# Altium project FPGA扩展板.PrjPcb
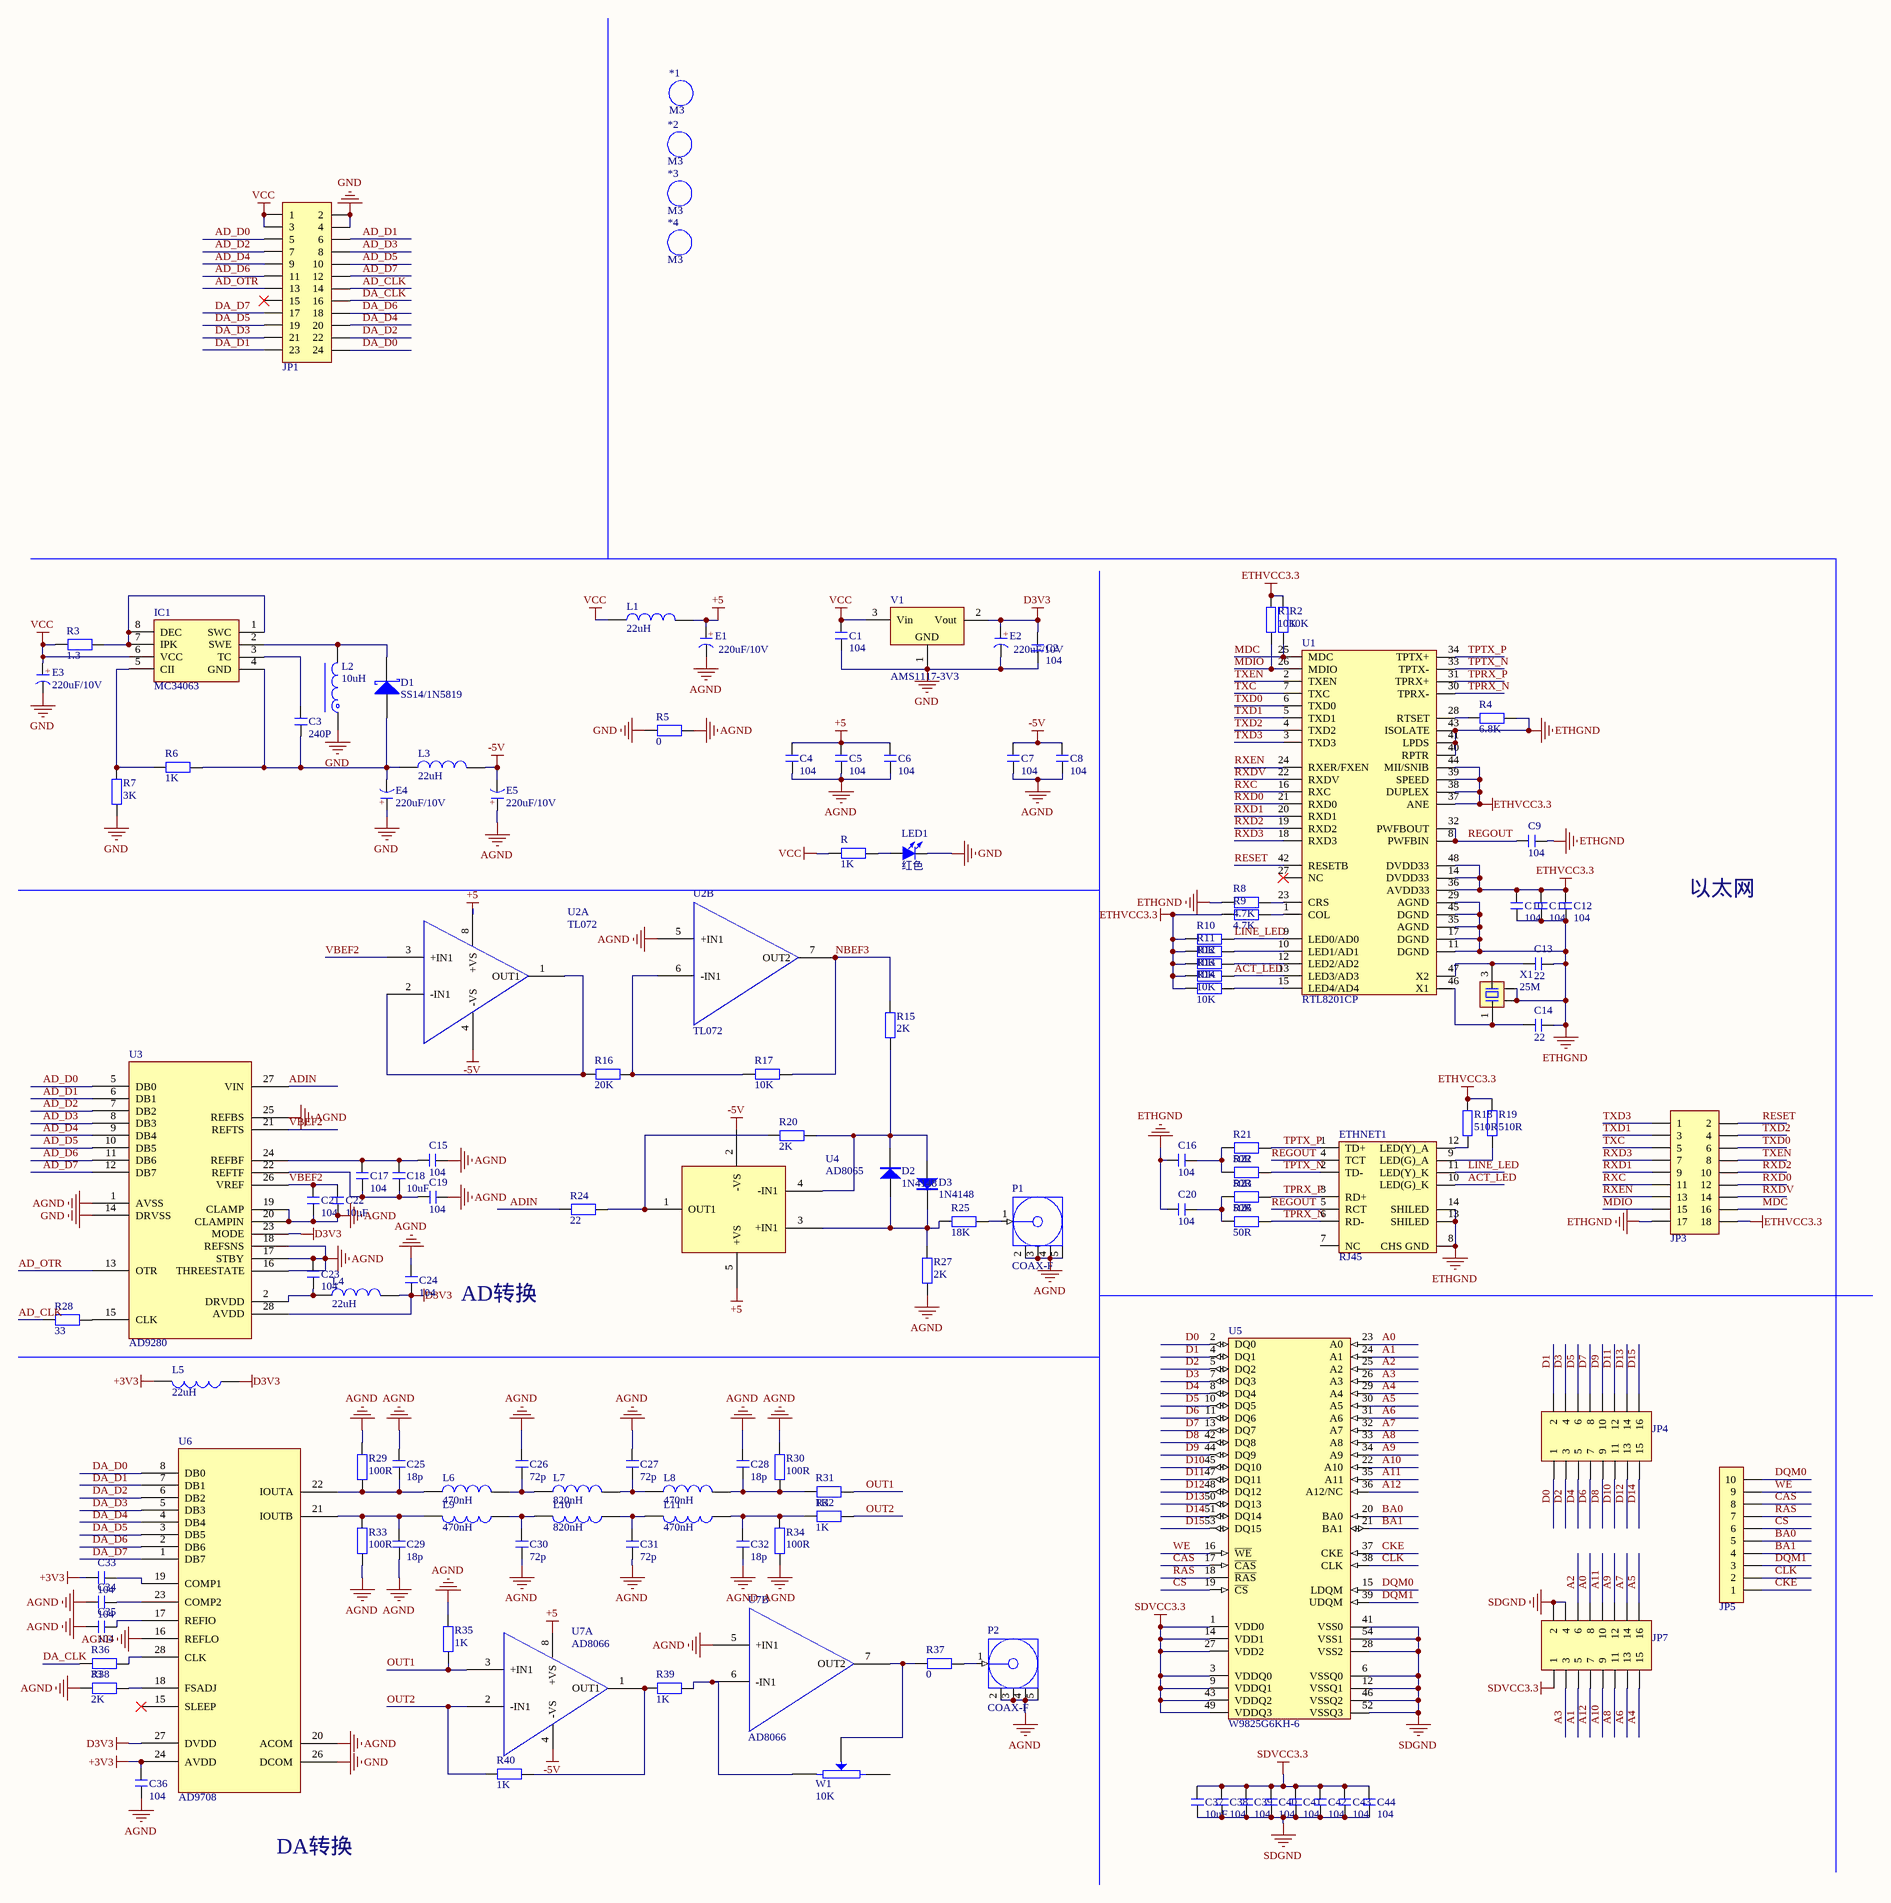
[diagram p0: FPGA扩展板.SchDoc]
1 sheet, 128 parts. Net scope: global (net labels, ports and power ports of the same name join across sheets).
Board file: FPGA扩展板.PcbDoc

## Sheet FPGA扩展板.SchDoc
size A2

### Parts
*1  M3  [M3 125X300]
*2  M3  [M3 125X300]
*3  M3  [M3 125X300]
*4  M3  [M3 125X300]
C1  104  [C 0805_L]
C2  104  [C 0805_L]
C3  240P  [C 0805_L]
C4  104  [C 0805_L]
C5  104  [C 0805_L]
C6  104  [C 0805_L]
C7  104  [C 0805_L]
C8  104  [C 0805_L]
C9  104  [C 0805_L]
C10  104  [C 0805_L]
C11  104  [C 0805_L]
C12  104  [C 0805_L]
C13  22  [C 0805_L]
C14  22  [C 0805_L]
C15  104  [C 0805_L]
C16  104  [C 0805_L]
C17  104  [C 0805_L]
C18  10uF  [C 0805_L]
C19  104  [C 0805_L]
C20  104  [C 0805_L]
C21  104  [C 0805_L]
C22  10uF  [C 0805_L]
C23  104  [C 0805_L]
C24  104  [C 0805_L]
C25  18p  [C 0805_L]
C26  72p  [C 0805_L]
C27  72p  [C 0805_L]
C28  18p  [C 0805_L]
C29  18p  [C 0805_L]
C30  72p  [C 0805_L]
C31  72p  [C 0805_L]
C32  18p  [C 0805_L]
C33  104  [C 0805_L]
C34  104  [C 0805_L]
C35  104  [C 0805_L]
C36  104  [C 0805_L]
C37  10uF  [C 0805_L]
C38  104  [C 0805_L]
C39  104  [C 0805_L]
C40  104  [C 0805_L]
C41  104  [C 0805_L]
C42  104  [C 0805_L]
C43  104  [C 0805_L]
C44  104  [C 0805_L]
D1  SS14/1N5819  [SMA]
D2  1N4148  [MINI_MELF (LL34)]
D3  1N4148  [MINI_MELF (LL34)]
E1  220uF/10V  [CM D(6.3*5.4)]
E2  220uF/10V  [CM D(6.3*5.4)]
E3  220uF/10V  [CM D(6.3*5.4)]
E4  220uF/10V  [CM D(6.3*5.4)]
E5  220uF/10V  [CM D(6.3*5.4)]
ETHNET1  RJ45  [HR911105A]
IC1  MC34063  [SOP8_N]
JP1  Header 2X11  [HDR2.54-LI-2x12P]  (value not drawn)
JP3  Header 9X2  [HDR2.54-LI-2x9P]  (value not drawn)
JP4  Header 8X2  [HDR2.54-LI-2x8P]  (value not drawn)
JP5  HDR-1X10  [HDR2.54-LI-10P]  (value not drawn)
JP7  Header 8X2  [HDR2.54-LI-2x8P]  (value not drawn)
L1  22uH  [L 0805]
L2  10uH  [CDRH73]
L3  22uH  [L 0805]
L4  22uH  [L 0805]
L5  22uH  [L 0805]
L6  470nH  [L 0805]
L7  820nH  [L 0805]
L8  470nH  [L 0805]
L9  470nH  [L 0805]
L10  820nH  [L 0805]
L11  470nH  [L 0805]
LED1  红色  [LED 0805B]
P1  COAX-F  [MCX5.08-H5]
P2  COAX-F  [MCX5.08-H5]
R  1K  [R 0805_L]
R1  10K  [R 0805_L]
R2  10K  [R 0805_L]
R3  1.3  [R 0805_L]
R4  6.8K  [R 0805_L]
R5  0  [R 0805_L]
R6  1K  [R 0805_L]
R7  3K  [R 0805_L]
R8  4.7K  [R 0805_L]
R9  4.7K  [R 0805_L]
R10  10K  [R 0805_L]
R11  10K  [R 0805_L]
R12  10K  [R 0805_L]
R13  10K  [R 0805_L]
R14  10K  [R 0805_L]
R15  2K  [R 0805_L]
R16  20K  [R 0805_L]
R17  10K  [R 0805_L]
R18  510R  [R 0805_L]
R19  510R  [R 0805_L]
R20  2K  [R 0805_L]
R21  50R  [R 0805_L]
R22  50R  [R 0805_L]
R23  50R  [R 0805_L]
R24  22  [R 0805_L]
R25  18K  [R 0805_L]
R26  50R  [R 0805_L]
R27  2K  [R 0805_L]
R28  33  [R 0805_L]
R29  100R  [R 0805_L]
R30  100R  [R 0805_L]
R31  1K  [R 0805_L]
R32  1K  [R 0805_L]
R33  100R  [R 0805_L]
R34  100R  [R 0805_L]
R35  1K  [R 0805_L]
R36  33  [R 0805_L]
R37  0  [R 0805_L]
R38  2K  [R 0805_L]
R39  1K  [R 0805_L]
R40  1K  [R 0805_L]
U1  RTL8201CP  [lqfp48s]
U2  TL072  [SOIC8YG]  (parts A,B of 2)
U3  AD9280  [LC-SSOP-28_208mil]
U4  AD8065  [SOT23-5]
U5  W9825G6KH-6  [TSOP54]
U6  AD9708  [TSOP28]
U7  AD8066  [SOIC8YG]  (parts A,B of 2)
V1  AMS1117-3V3  [SOT223_N]
W1  10K  [10K RW]
X1  25M  [OSC 3225-4P]

### Nets
+3V3: C33.1 C36.1 L5.2 U6.24(AVDD)
+5: C4.2 C5.2 C6.2 E1.1(A) L1.2 U2.8(+VS) U4.5(+VS) U7.8(+VS)
-5V: C7.2 C8.2 E5.2(K) L3.2 U2.4(-VS) U4.2(-VS) U7.4(-VS)
AGND: C4.1 C5.1 C6.1 C7.1 C8.1 C15.1 C19.2 C21.1 C22.1 C23.2 C24.1 C25.1 C26.1 C27.1 C28.1 C29.1 C30.1 C31.1 C32.1 C34.1 C35.1 C36.2 E1.2(K) E5.1(A) P1.2(GND) P1.3(GND) P1.4(GND) P1.5(GND) P2.2(GND) P2.3(GND) P2.4(GND) P2.5(GND) R5.1 R27.1 R29.1 R30.1 R33.2 R34.2 R35.2 R38.2 U2.5(+IN1) U3.1(AVSS) U3.16(THREESTATE) U3.17(STBY) U3.18(REFSNS) U3.19(CLAMP) U3.20(CLAMPIN) U3.25(REFBS) U6.16(REFLO) U6.20(ACOM) U7.5(+IN1)
D3V3: C2.2 C24.2 E2.1(A) L4.2 L5.1 U3.23(MODE) U3.28(AVDD) U6.27(DVDD) V1.2(Vout)
ETHGND: C9.1 C10.1 C11.1 C12.1 C13.2 C14.2 C16.2 C20.2 ETHNET1.8(CHS_GND) ETHNET1.13(SHILED) ETHNET1.14(SHILED) JP3.17 R4.2 R8.1 U1.11(DGND) U1.17(DGND) U1.29(AGND) U1.35(AGND) U1.40(RPTR) U1.41(LPDS) U1.43(ISOLATE) U1.45(DGND) X1.2 X1.4
ETHVCC3.3: C10.2 C11.2 C12.2 JP3.18 R1.2 R2.2 R9.1 R10.1 R11.1 R12.1 R13.1 R14.1 R18.2 R19.2 U1.14(DVDD33) U1.36(AVDD33) U1.37(ANE) U1.38(DUPLEX) U1.39(SPEED) U1.44(MII/SNIB) U1.48(DVDD33)
GND: C1.1 C2.1 E2.2(K) E3.2(K) E4.1(A) JP1.2 JP1.4 L2.1 LED1.2(K) R5.2 R7.1 U3.14(DRVSS) U6.26(DCOM) V1.1(GND)
SDGND: C37.1 C38.1 C39.1 C40.1 C41.1 C42.1 C43.1 C44.1 JP7.2 JP7.4 U5.6(VSSQ0) U5.12(VSSQ1) U5.28(VSS2) U5.41(VSS0) U5.46(VSSQ2) U5.52(VSSQ3) U5.54(VSS1)
SDVCC3.3: C37.2 C38.2 C39.2 C40.2 C41.2 C42.2 C43.2 C44.2 JP7.1 U5.1(VDD0) U5.3(VDDQ0) U5.9(VDDQ1) U5.14(VDD1) U5.27(VDD2) U5.43(VDDQ2) U5.49(VDDQ3)
VCC: C1.2 E3.1(A) IC1.6(VCC) JP1.1 JP1.3 L1.1 R.2 R3.1 V1.3(Vin)
A0: JP7.8 U5.23(A0)
A1: JP7.5 U5.24(A1)
A2: JP7.6 U5.25(A2)
A3: JP7.3 U5.26(A3)
A4: JP7.15 U5.29(A4)
A5: JP7.16 U5.30(A5)
A6: JP7.13 U5.31(A6)
A7: JP7.14 U5.32(A7)
A8: JP7.11 U5.33(A8)
A9: JP7.12 U5.34(A9)
A10: JP7.9 U5.22(A10)
A11: JP7.10 U5.35(A11)
A12: JP7.7 U5.36(A12/NC)
ACT_LED: ETHNET1.10(LED(G)_K) R13.2 U1.13(LED3/AD3)
AD_CLK: JP1.14 R28.2
AD_D0: JP1.5 U3.5(DB0)
AD_D1: JP1.6 U3.6(DB1)
AD_D2: JP1.7 U3.7(DB2)
AD_D3: JP1.8 U3.8(DB3)
AD_D4: JP1.9 U3.9(DB4)
AD_D5: JP1.10 U3.10(DB5)
AD_D6: JP1.11 U3.11(DB6)
AD_D7: JP1.12 U3.12(DB7)
AD_OTR: JP1.13 U3.13(OTR)
ADIN: R24.2 U3.27(VIN)
BA0: JP5.5 U5.20(BA0)
BA1: JP5.4 U5.21(BA1)
CAS: JP5.8 U5.17(~{CAS})
CKE: JP5.1 U5.37(CKE)
CLK: JP5.2 U5.38(CLK)
CS: JP5.6 U5.19(~{CS})
D0: JP4.1 U5.2(DQ0)
D1: JP4.2 U5.4(DQ1)
D2: JP4.3 U5.5(DQ2)
D3: JP4.4 U5.7(DQ3)
D4: JP4.5 U5.8(DQ4)
D5: JP4.6 U5.10(DQ5)
D6: JP4.7 U5.11(DQ6)
D7: JP4.8 U5.13(DQ7)
D8: JP4.9 U5.42(DQ8)
D9: JP4.10 U5.44(DQ9)
D10: JP4.11 U5.45(DQ10)
D11: JP4.12 U5.47(DQ11)
D12: JP4.13 U5.48(DQ12)
D13: JP4.14 U5.50(DQ13)
D14: JP4.15 U5.51(DQ14)
D15: JP4.16 U5.53(DQ15)
DA_CLK: JP1.16 R36.2
DA_D0: JP1.24 U6.8(DB0)
DA_D1: JP1.23 U6.7(DB1)
DA_D2: JP1.22 U6.6(DB2)
DA_D3: JP1.21 U6.5(DB3)
DA_D4: JP1.20 U6.4(DB4)
DA_D5: JP1.19 U6.3(DB5)
DA_D6: JP1.18 U6.2(DB6)
DA_D7: JP1.17 U6.1(DB7)
DQM0: JP5.10 U5.15(LDQM)
DQM1: JP5.3 U5.39(UDQM)
LINE_LED: ETHNET1.11(LED(Y)_K) R10.2 U1.9(LED0/AD0)
MDC: JP3.16 R2.1 U1.25(MDC)
MDIO: JP3.15 R1.1 U1.26(MDIO)
NBEF3: R15.2 R17.1 U2.7(OUT2)
OUT1: R31.2 R35.1 U7.3(+IN1)
OUT2: R32.2 R40.2 U7.2(-IN1)
RAS: JP5.7 U5.18(~{RAS})
REGOUT: C9.2 ETHNET1.4(TCT) ETHNET1.5(RCT) U1.8(PWFBIN) U1.32(PWFBOUT)
RESET: JP3.2 U1.42(RESETB)
RXC: JP3.11 U1.16(RXC)
RXD0: JP3.12 U1.21(RXD0)
RXD1: JP3.9 U1.20(RXD1)
RXD2: JP3.10 U1.19(RXD2)
RXD3: JP3.7 U1.18(RXD3)
RXDV: JP3.14 U1.22(RXDV)
RXEN: JP3.13 U1.24(RXER/FXEN)
TPRX_N: ETHNET1.6(RD-) R26.2 U1.30(TPRX-)
TPRX_P: ETHNET1.3(RD+) R23.2 U1.31(TPRX+)
TPTX_N: ETHNET1.2(TD-) R22.2 U1.33(TPTX-)
TPTX_P: ETHNET1.1(TD+) R21.2 U1.34(TPTX+)
TXC: JP3.5 U1.7(TXC)
TXD0: JP3.6 U1.6(TXD0)
TXD1: JP3.3 U1.5(TXD1)
TXD2: JP3.4 U1.4(TXD2)
TXD3: JP3.1 U1.3(TXD3)
TXEN: JP3.8 U1.2(TXEN)
VBEF2: C21.2 C22.2 U2.3(+IN1) U3.21(REFTS) U3.26(VREF)
WE: JP5.9 U5.16(~{WE})
NetC3_1: C3.1 D1.1(A) E4.2(K) IC1.4(GND) L3.1 R6.1
NetC3_2: C3.2 IC1.3(TC)
NetC13_1: C13.1 U1.47(X2) X1.3
NetC14_1: C14.1 U1.46(X1) X1.1
NetC15_2: C15.2 C17.2 C18.2 U3.24(REFBF)
NetC16_1: C16.1 R21.1 R22.1
NetC17_1: C17.1 C18.1 C19.1 U3.22(REFTF)
NetC20_1: C20.1 R23.1 R26.1
NetC23_1: C23.1 L4.1 U3.2(DRVDD)
NetC25_2: C25.2 L6.1 R29.2 U6.22(IOUTA)
NetC26_2: C26.2 L6.2 L7.1
NetC27_2: C27.2 L7.2 L8.1
NetC28_2: C28.2 L8.2 R30.2 R31.1
NetC29_2: C29.2 L9.2 R33.1 U6.21(IOUTB)
NetC30_2: C30.2 L9.1 L10.2
NetC31_2: C31.2 L10.1 L11.2
NetC32_2: C32.2 L11.1 R32.1 R34.1
NetC33_2: C33.2 U6.19(COMP1)
NetC34_2: C34.2 U6.23(COMP2)
NetC35_2: C35.2 U6.17(REFIO)
NetD1_2: D1.2(K) IC1.2(SWE) L2.2
NetD2_1: D2.1(A) D3.2(K) R25.2 R27.2 U4.3(+IN1)
NetD2_2: D2.2(K) D3.1(A) R15.1 R20.1 U4.4(-IN1)
NetETHNET1_9: ETHNET1.9(LED(G)_A) R19.1
NetETHNET1_12: ETHNET1.12(LED(Y)_A) R18.1
NetIC1_1: IC1.1(SWC) IC1.7(IPK) IC1.8(DEC) R3.2
NetIC1_5: IC1.5(CII) R6.2 R7.2
NetLED1_1: LED1.1(A) R.1
NetP1_1: P1.1(Signal) R25.1
NetP2_1: P2.1(Signal) R37.1
NetR4_1: R4.1 U1.28(RTSET)
NetR8_2: R8.2 U1.23(CRS)
NetR9_2: R9.2 U1.1(COL)
NetR11_2: R11.2 U1.10(LED1/AD1)
NetR12_2: R12.2 U1.12(LED2/AD2)
NetR14_2: R14.2 U1.15(LED4/AD4)
NetR16_1: R16.1 R17.2 U2.6(-IN1)
NetR16_2: R16.2 U2.1(OUT1) U2.2(-IN1)
NetR20_2: R20.2 R24.1 U4.1(OUT1)
NetR28_1: R28.1 U3.15(CLK)
NetR36_1: R36.1 U6.28(CLK)
NetR37_2: R37.2 U7.7(OUT2) W1.2(W)
NetR38_1: R38.1 U6.18(FSADJ)
NetR39_1: R39.1 U7.6(-IN1) W1.3
NetR39_2: R39.2 R40.1 U7.1(OUT1)

Not connected (* = marked no-connect by the designer): ETHNET1 7(NC); JP1 15*; U1 27(NC)*; U6 15(SLEEP)*; W1 1

### Notes on the sheet
- 以太网
- AD转换
- DA转换
- (in symbol CE_SMD) +

### Library data of the parts
*1-*4 = M3: 铜柱孔; 版权归属: 封装库来自淘宝 ID：黄晶宝石; BOM名称: 铜柱孔; 学习资源: https://shop463601444.taobao.com
C1-C44 = C: 贴片电容; BOM名称: 无极性贴片电容; 淘宝ID: 封装库来自淘宝 ID：黄晶宝石; 联系售后: https://shop463601444.taobao.com
D1 = SS14: 肖特基二极管; 属性: 40V/1A; BOM名称: 肖特基二极管; 封装库来自淘宝 ID：黄晶宝石: https://shop463601444.taobao.com
D2 D3 = 1N4148: 开关二极管; BOM名称: 高速开关二极管; 淘宝ID: 封装库来自淘宝 ID：黄晶宝石; 欢迎光临: https://shop463601444.taobao.com
E1-E5 = CE_SMD: 贴片电解电容; 版权归属: 封装库来自淘宝 ID：黄晶宝石; BOM名称: 贴片电解电容; 联系售后: https://shop463601444.taobao.com
ETHNET1 = HR911105
IC1 = MC34063: DC升降压芯片; 版权归属: 封装库来自淘宝 ID：黄晶宝石; BOM名称: DC升降压芯片; 学习资源: https://shop463601444.taobao.com
JP1 = Header 12X2: 12*2P接插件; 版权归属: 源创客; BOM名称: 12*2P接插件; 学习资源: www.ooocke.com
JP3 = Header 9X2: 9*2P接插件; 版权归属: 源创客; BOM名称: 9*2P接插件; 学习资源: www.ooocke.com
JP4 JP7 = Header 8X2: 8*2P接插件; 版权归属: 封装库来自淘宝 ID：黄晶宝石; BOM名称: 8*2P接插件; 学习资源: https://shop463601444.taobao.com
JP5 = Header 10: 10P接插件; 版权归属: 源创客; BOM名称: 10P接插件; 学习资源: www.ooocke.com
L1 L3-L11 = L: 小功率贴片电感; 淘宝ID: 封装库来自淘宝 ID：黄晶宝石; BOM名称: 小功率贴片电感; 联系售后: https://shop463601444.taobao.com
L2 = L-CDRH: 功率屏蔽电感; 版权归属: 封装库来自淘宝 ID：黄晶宝石; BOM名称: 功率屏蔽电感; 联系售后: https://shop463601444.taobao.com
LED1 = LED-SMD: 贴片LED; 版权归属: 封装库来自淘宝 ID：黄晶宝石; BOM名称: 贴片LED; 学习资源: https://shop463601444.taobao.com
P1 P2 = COAX-F: RF Coaxial PCB Connector, MCX; Thru-Hole, Right-Angle Mount Socket, Blunt Post Terminal, 50 Ohm Impedance; PCB_Layout: Complies with manufacturer's recommendation.; DrillSize: Corresponds to nominal value.; Published: 15-Jul-2004; LatestRevisionDate: 15-Jul-2004; LatestRevisionNote: Component Replaced.; DatasheetDocument: 30-May-2003; PackageDocument: 04-Jul-1999; PackageReference: 919-119J-51AX; Publisher: Altium Limited; ComponentLink1Description: Manufacturer Link; ComponentLink1URL: http://www.amphenolrf.com/
R R1-R40 = R: 贴片电阻; 版权归属: 来自淘宝 ID：黄晶宝石; BOM名称: 贴片电阻; 联系售后: https://shop463601444.taobao.com
U1 = RTL8201CP: ETH PHY
U5 = IS42S16160B: 32MB SDRAM
V1 = AMS1117: 三端稳压芯片; BOM名称: 稳压芯片; 淘宝ID: 封装库来自淘宝 ID：黄晶宝石; 欢迎光临淘宝店铺: https://shop463601444.taobao.com
W1 = POT2: Potentiometer
X1 = XTAL-4P: 4脚无源晶振; 版权归属: 源创客; BOM名称: 4脚无源晶振; 学习资源: www.ooocke.com